# EAGLE schematic avrdroid (EAGLE 6.4)
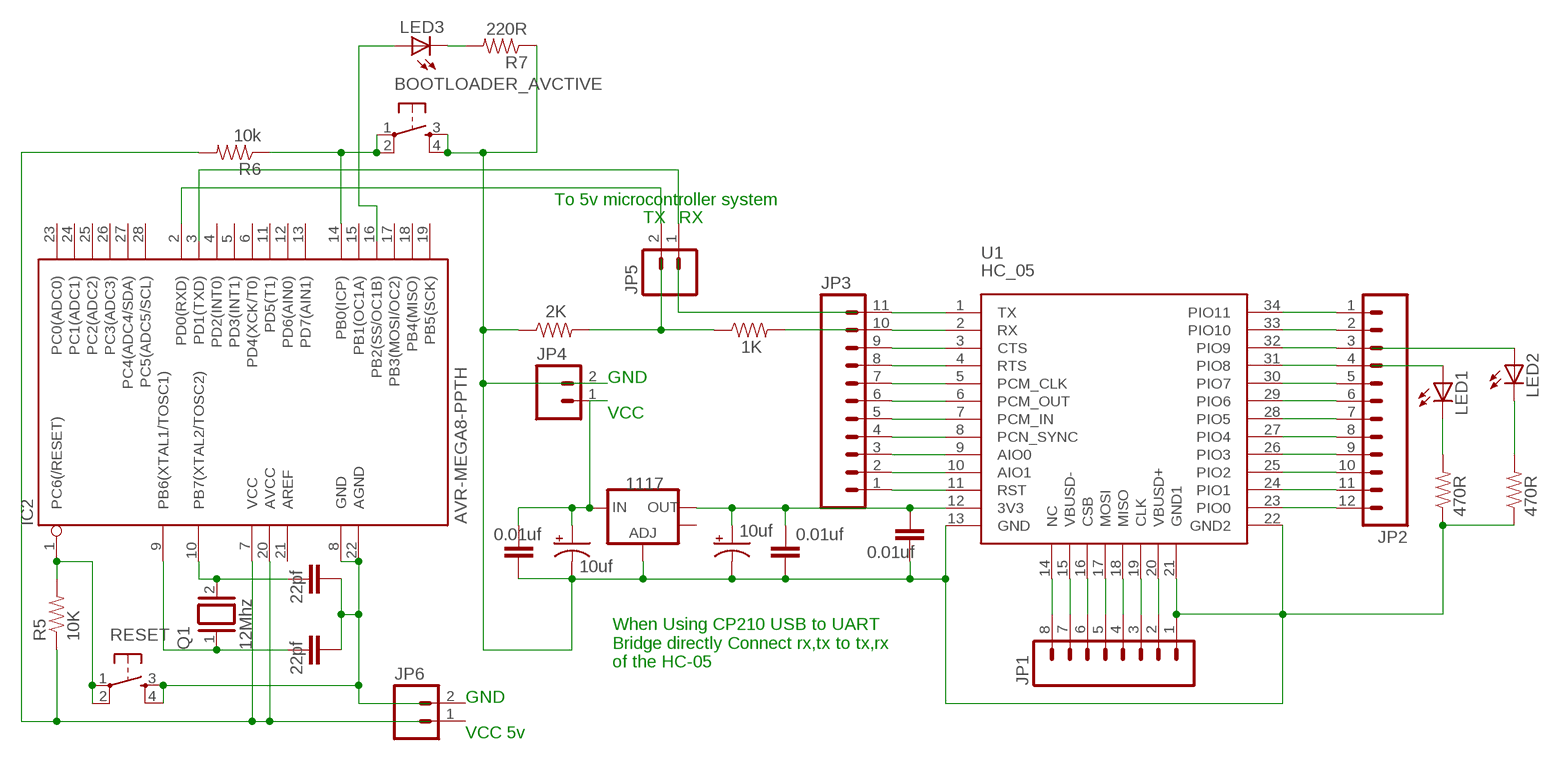
[diagram p0: schematic, sheet 1]

## Parts
BOOTLOADER_AVCTIVE  TAC_SWITCH12MM  [TACTILE-PTH-12MM]
C1  10uf  CAP_POL1206  [EIA3216]
C2  10uf  CAP_POL1206  [EIA3216]
C3  0.01uf  CAPPTH  [CAP-PTH-SMALL]
C4  0.01uf  CAPPTH  [CAP-PTH-SMALL]
C5  0.01uf  CAPPTH  [CAP-PTH-SMALL]
C6  22pf  CAPPTH  [CAP-PTH-SMALL]
C7  22pf  CAPPTH  [CAP-PTH-SMALL]
IC1  1117  V_REG_LM1117SOT223  [SOT223]
IC2  AVR-MEGA8-PPTH  [DIL28-3]
JP1  M08  [1X08]
JP2  M12PTH  [1X12]
JP3  M11PTH  [1X11]
JP4  M02PTH  [1X02]
JP5  M02  [1X02_LONGPADS]
JP6  M02PTH  [1X02]
LED1  LED3MM  [LED3MM]
LED2  LED3MM  [LED3MM]
LED3  LED3MM  [LED3MM]
Q1  12Mhz  XTAL/S  [QS]
R1  1K  RESISTORPTH1  [AXIAL-0.3]
R2  2K  RESISTORPTH1  [AXIAL-0.3]
R3  470R  RESISTORPTH1  [AXIAL-0.3]
R4  470R  RESISTORPTH1  [AXIAL-0.3]
R5  10K  RESISTORPTH1  [AXIAL-0.3]
R6  10k  RESISTORPTH1  [AXIAL-0.3]
R7  220R  RESISTORPTH1  [AXIAL-0.3]
RESET  TAC_SWITCH12MM  [TACTILE-PTH-12MM]
U1  HC_05  [BLUETOOTH_SMD]

## Nets
N$1: C1.A(+) C4.1 IC1.3(IN) JP4.1
N$2: C2.A(+) C3.1 C5.1 IC1.2(OUT) U1.12(3V3)
N$3: LED1.K(C) R3.P$2
N$5: LED1.A
N$6: LED2.A
N$7: LED2.K(C) R4.P$2
N$8: JP1.8 U1.14(NC)
N$9: JP3.11 U1.1(TX)
N$10: JP3.10 U1.2(RX)
N$11: JP3.9 U1.3(CTS)
N$12: JP3.8 U1.4(RTS)
N$13: JP3.7 U1.5(PCM_CLK)
N$14: JP3.6 U1.6(PCM_OUT)
N$15: JP3.5 U1.7(PCM_IN)
N$16: JP3.4 U1.8(PCN_SYNC)
N$17: JP3.3 U1.9(AIO0)
N$18: JP3.2 U1.10(AIO1)
N$19: JP3.1 U1.11(RST)
N$20: JP2.1 U1.34(PIO11)
N$21: JP2.2 U1.33(PIO10)
N$22: JP2.3 U1.32(PIO9)
N$23: JP2.4 U1.31(PIO8)
N$24: JP2.5 U1.30(PIO7)
N$25: JP2.6 U1.29(PIO6)
N$26: JP2.7 U1.28(PIO5)
N$27: JP2.8 U1.27(PIO4)
N$28: JP2.9 U1.26(PIO3)
N$29: JP2.10 U1.25(PIO2)
N$30: JP2.11 U1.24(PIO1)
N$31: JP2.12 U1.23(PIO0)
N$32: JP1.5 U1.17(MOSI)
N$33: JP1.7 U1.15(VBUSD-)
N$34: JP1.6 U1.16(CSB)
N$35: BOOTLOADER_AVCTIVE.3 BOOTLOADER_AVCTIVE.4 C1.C(-) C2.C(-) C3.2 C4.2 C5.2 IC1.1(ADJ) JP1.1 JP4.2 R2.P$1 R3.P$1 R4.P$1 R7.P$1 U1.13(GND) U1.21(GND1) U1.22(GND2)
N$36: JP1.4 U1.18(MISO)
N$37: JP1.3 U1.19(CLK)
N$38: JP1.2 U1.20(VBUSD+)
N$39: R1.P$2
N$40: R1.P$1 R2.P$2
N$41: IC2.2(PD0(RXD)) JP5.2
N$42: JP5.1
N$43: C6.1 IC2.9(PB6(XTAL1/TOSC1)) Q1.1
N$44: IC2.1(PC6(/RESET)) R5.P$2 RESET.1 RESET.2
N$45: C7.1 IC2.10(PB7(XTAL2/TOSC2)) Q1.2
N$46: BOOTLOADER_AVCTIVE.1 BOOTLOADER_AVCTIVE.2 IC2.14(PB0(ICP)) R6.P$1
N$47: IC2.7(VCC) IC2.20(AVCC) R5.P$1 R6.P$2
N$48: LED3.A
N$49: LED3.K(C) R7.P$2
N$51: C6.2 C7.2 IC2.8(GND) IC2.22(AGND) RESET.3 RESET.4
Unconnected: IC1.4(OUT) IC2.3(PD1(TXD)) IC2.4(PD2(INT0)) IC2.5(PD3(INT1)) IC2.6(PD4(XCK/T0)) IC2.11(PD5(T1)) IC2.12(PD6(AIN0)) IC2.13(PD7(AIN1)) IC2.15(PB1(OC1A)) IC2.16(PB2(SS/OC1B)) IC2.17(PB3(MOSI/OC2)) IC2.18(PB4(MISO)) IC2.19(PB5(SCK)) IC2.21(AREF) IC2.23(PC0(ADC0)) IC2.24(PC1(ADC1)) IC2.25(PC2(ADC2)) IC2.26(PC3(ADC3)) IC2.27(PC4(ADC4/SDA)) IC2.28(PC5(ADC5/SCL)) JP6.1 JP6.2

## Notes on the sheet
- To 5v microcontroller system
- TX | RX
- GND
- VCC
- When Using CP210 USB to UART
   Bridge directly Connect rx,tx to tx,rx
   of the HC-05
- GND
- VCC 5v

## Library data of the parts
BOOTLOADER_AVCTIVE RESET = SparkFun:TAC_SWITCH: Momentary Switch Button commonly used for reset or general input. Spark Fun Electronics SKU : COM-00097
C1 C2 = SparkFun:CAP_POL: Capacitor Polarized These are standard SMD and PTH capacitors. Normally 10uF, 47uF, and 100uF in electrolytic and tantalum varieties. Always verify the external diameter of the through hole cap, it varies with capacity, voltage, and manufacturer. The EIA devices should be standard.
C3-C7 = SparkFun:CAP: Capacitor Standard 0603 ceramic capacitor, and 0.1" leaded capacitor.
IC1 = SparkFun:V_REG_LM1117: Voltage Regulator LM1117 Standard adjustable voltage regulator but in SMD form. Spark Fun Electronics SKU : COM-00595
IC2 = SparkFun:AVR-MEGA8-P: MICROCONTROLLER 8 Kbytes FLASH 1 kbytes SRAM 512 bytes EEPROM USART 4-channel 10 bit ADC 2-channel 8 bit ADC
JP1 = SparkFun:M08: Header 8 Standard 8-pin 0.1" header. Use with straight break away headers (SKU : PRT-00116), right angle break away headers (PRT-00553), swiss pins (PRT-00743), machine pins (PRT-00117), and female headers (PRT-00115).
JP2 = SparkFun:M12: Header 12 Standard 12-pin 0.1" header. Use with straight break away headers (SKU : PRT-00116), right angle break away headers (PRT-00553), swiss pins (PRT-00743), machine pins (PRT-00117), and female headers (PRT-00115).
JP3 = SparkFun:M11: Header 11 Standard 11-pin 0.1" header. Use with straight break away headers (SKU : PRT-00116), right angle break away headers (PRT-00553), swiss pins (PRT-00743), machine pins (PRT-00117), and female headers (PRT-00115).
JP4-JP6 = SparkFun:M02: Header 2 Standard 2-pin 0.1" header. Use with straight break away headers (SKU : PRT-00116), right angle break away headers (PRT-00553), swiss pins (PRT-00743), machine pins (PRT-00117), and female headers (PRT-00115). Molex polarized connector foot print use with SKU : PRT-08233 with associated crimp pins and housings.
LED1-LED3 = adafruit:LED: LED OSRAM: - CHIPLED LG R971, LG N971, LY N971, LG Q971, LY Q971, LO R971, LY R971 LH N974, LH R974 LS Q976, LO Q976, LY Q976 LO Q996 - Hyper CHIPLED LW Q18S LB Q993, LB Q99A, LB R99A - SideLED LS A670, LO A670, LY A670, LG A670, LP A670 LB A673, LV A673, LT A673, LW A673 LH A674 LY A675 LS A676, LA A676, LO A676, LY A676, LW A676 LS A679, LY A679, LG A679 - Hyper Micro SIDELED® LS Y876, LA Y876, LO Y876, LY Y876 LT Y87S - SmartLED LW L88C, LW L88S LB L89C, LB L89S, LG L890 LS L89K, LO L89K, LY L89K LS L896, LA L896, LO L896, LY L896 - TOPLED LS T670, LO T670, LY T670, LG T670, LP T670 LSG T670, LSP T670, LSY T670, LOP T670, LYG T670 LG T671, LOG T671, LSG T671 LB T673, LV T673, LT T673, LW T673 LH T674 LS T676, LA T676, LO T676, LY T676, LB T676, LH T676, LSB T676, LW T676 LB T67C, LV T67C, LT T67C, LS T67K, LO T67K, LY T67K, LW E67C LS E67B, LA E67B, LO E67B, LY E67B, LB E67C, LV E67C, LT E67C LW T67C LS T679, LY T679, LG T679 LS T770, LO T770, LY T770, LG T770, LP T770 LB T773, LV T773, LT T773, LW T773 LH T774 LS E675, LA E675, LY E675, LS T675 LS T776, LA T776, LO T776, LY T776, LB T776 LHGB T686 LT T68C, LB T68C - Hyper Mini TOPLED® LB M676 - Mini TOPLED Santana® LG M470 LS M47K, LO M47K, LY M47K Source: http://www.osram.convergy.de/
Q1 = special:XTAL/S: CRYSTAL
R1-R7 = SparkFun:RESISTOR: Resistor Basic schematic elements and footprints for 0603, 1206, and PTH 1/10th watt (small) resistors.
U1 = SerialPortBluetooth:HC_05